# Altium schematic sheet XL-1005UOC1_XL-1005UOC.schdoc
size 127 x 101 mm
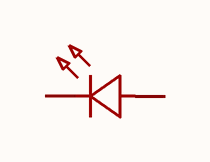
[diagram p0: XL-1005UOC1_XL-1005UOC.schdoc]

## Parts
U?  XL-1005UOC  [LED0402-RD_ORANGE]  (value not drawn)

## Nets

Not connected (* = marked no-connect by the designer): U? 1(K) 2(A)

## Library data of the parts
U? = XL-1005UOC: Manufacturer: XINGLIGHT(成兴光); Add into BOM: yes; Illumination Color: 橙色; Voltage - Forward(Vf): 2.3V; Power(Watts): 50mW; Forward Current: 20mA; Wavelength - Dominant: 600nm~610nm; Peak Wavelength: 605nm; Lens Color: 无色透明透镜; Luminous Intensity: 350mcd; Viewing Angle: 120°; Symbol: XL-1005UOC; Device: XL-1005UOC; LCSC Part Name: 0402橙贴片式发光二极管; Supplier Part: C965791; Manufacturer Part: XL-1005UOC; Supplier Footprint: 0402; JLCPCB Part Class: Extended Part; Datasheet: https://item.szlcsc.com/datasheet/XL-1005UOC/1051400.html; Supplier: LCSC; Convert to PCB: yes; Color Temperature: -; Mounting Style: 正贴; Operating Temperature: -40℃~+85℃